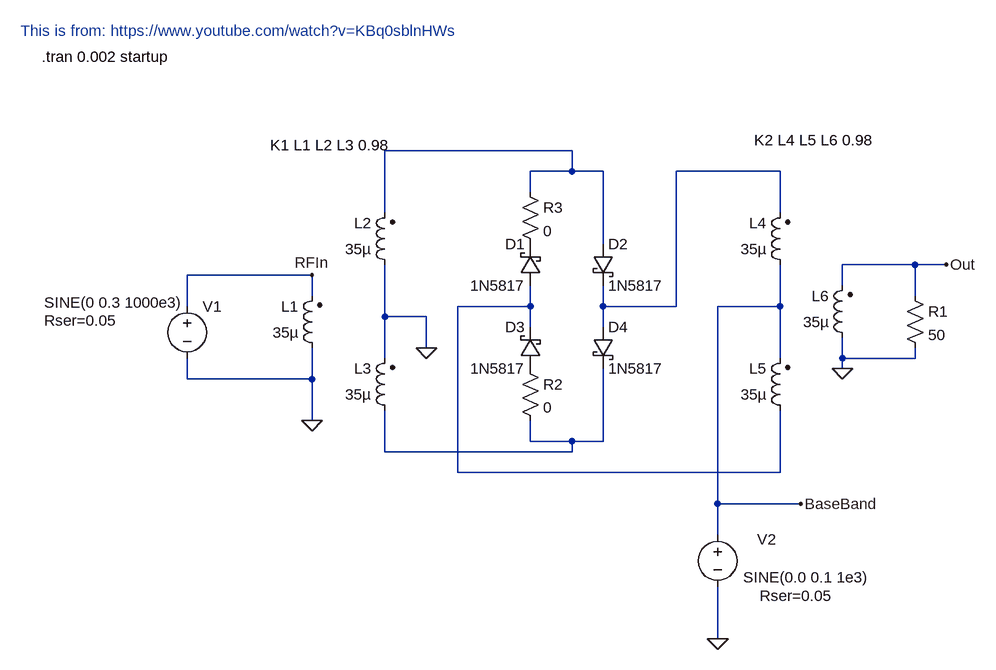
[diagram p0: schematic diode_ring_modulator_3.asc]
diode_ring_modulator_3.asc, the LTspice schematic file:
Version 4
SHEET 1 2596 716
WIRE 432 -112 144 -112
WIRE 432 -80 432 -112
WIRE 432 -80 368 -80
WIRE 480 -80 432 -80
WIRE 752 -80 592 -80
WIRE 368 -48 368 -80
WIRE 144 -16 144 -112
WIRE 752 -16 752 -80
WIRE 480 32 480 -80
WIRE 960 64 848 64
WIRE 1008 64 960 64
WIRE 32 80 -160 80
WIRE 848 96 848 64
WIRE 32 112 32 80
WIRE 960 112 960 64
WIRE -160 128 -160 80
WIRE 368 128 368 96
WIRE 368 128 256 128
WIRE 480 128 480 96
WIRE 592 128 592 -80
WIRE 592 128 480 128
WIRE 752 128 752 64
WIRE 752 128 656 128
WIRE 144 144 144 64
WIRE 208 144 144 144
WIRE 368 160 368 128
WIRE 480 160 480 128
WIRE 208 192 208 144
WIRE 144 208 144 144
WIRE 752 208 752 128
WIRE 848 208 848 176
WIRE 960 208 960 192
WIRE 960 208 848 208
WIRE 848 224 848 208
WIRE -160 240 -160 208
WIRE 32 240 32 192
WIRE 32 240 -160 240
WIRE 32 304 32 240
WIRE 368 336 368 304
WIRE 432 336 368 336
WIRE 480 336 480 224
WIRE 480 336 432 336
WIRE 144 352 144 288
WIRE 432 352 432 336
WIRE 432 352 144 352
WIRE 256 384 256 128
WIRE 752 384 752 288
WIRE 752 384 256 384
WIRE 656 432 656 128
WIRE 784 432 656 432
WIRE 656 480 656 432
WIRE 656 640 656 560
FLAG 32 304 0
FLAG 848 224 0
FLAG 1008 64 Out
FLAG 208 192 0
FLAG 656 640 0
FLAG 32 80 RFIn
FLAG 784 432 BaseBand
SYMBOL ind2 48 208 R180
WINDOW 0 36 80 Left 2
WINDOW 3 36 40 Left 2
SYMATTR InstName L1
SYMATTR Value 35µ
SYMATTR Type ind
SYMBOL ind2 160 80 R180
WINDOW 0 36 80 Left 2
WINDOW 3 36 40 Left 2
SYMATTR InstName L2
SYMATTR Value 35µ
SYMATTR Type ind
SYMBOL ind2 160 304 R180
WINDOW 0 36 80 Left 2
WINDOW 3 36 40 Left 2
SYMATTR InstName L3
SYMATTR Value 35µ
SYMATTR Type ind
SYMBOL schottky 384 96 R180
WINDOW 0 24 64 Left 2
WINDOW 3 24 0 Left 2
SYMATTR InstName D1
SYMATTR Value 1N5817
SYMATTR Description Diode
SYMATTR Type diode
SYMBOL schottky 384 224 R180
WINDOW 0 24 64 Left 2
WINDOW 3 24 0 Left 2
SYMATTR InstName D3
SYMATTR Value 1N5817
SYMATTR Description Diode
SYMATTR Type diode
SYMBOL schottky 464 160 R0
SYMATTR InstName D4
SYMATTR Value 1N5817
SYMATTR Description Diode
SYMATTR Type diode
SYMBOL ind2 768 80 R180
WINDOW 0 36 80 Left 2
WINDOW 3 36 40 Left 2
SYMATTR InstName L4
SYMATTR Value 35µ
SYMATTR Type ind
SYMBOL ind2 768 304 R180
WINDOW 0 36 80 Left 2
WINDOW 3 36 40 Left 2
SYMATTR InstName L5
SYMATTR Value 35µ
SYMATTR Type ind
SYMBOL ind2 864 192 R180
WINDOW 0 36 80 Left 2
WINDOW 3 36 40 Left 2
SYMATTR InstName L6
SYMATTR Value 35µ
SYMATTR Type ind
SYMBOL voltage -160 112 R0
WINDOW 3 -220 10 Left 2
WINDOW 123 0 0 Left 0
WINDOW 39 -220 38 Left 2
SYMATTR Value SINE(0 0.3 1000e3)
SYMATTR SpiceLine Rser=0.05
SYMATTR InstName V1
SYMBOL voltage 656 464 R0
WINDOW 0 76 38 Bottom 2
WINDOW 3 136 66 Top 2
WINDOW 123 0 0 Left 0
WINDOW 39 121 94 Top 2
SYMATTR InstName V2
SYMATTR Value SINE(0.0 0.1 1e3)
SYMATTR SpiceLine Rser=0.05
SYMBOL res 944 96 R0
SYMATTR InstName R1
SYMATTR Value 50
SYMBOL schottky 464 32 R0
SYMATTR InstName D2
SYMATTR Value 1N5817
SYMATTR Description Diode
SYMATTR Type diode
SYMBOL res 352 208 R0
SYMATTR InstName R2
SYMATTR Value 0
SYMBOL res 352 -64 R0
SYMATTR InstName R3
SYMATTR Value 0
TEXT 712 -128 Left 2 !K2 L4 L5 L6 0.98
TEXT -32 -120 Left 2 !K1 L1 L2 L3 0.98
TEXT -384 -256 Left 2 !.tran 0.002 startup
TEXT -416 -296 Left 2 ;This is from: https://www.youtube.com/watch?v=KBq0sblnHWs

The netlist it stands for:
* diode_ring_modulator_3.asc
L1 0 RFIn 35µ
L2 0 N001 35µ
L3 N004 0 35µ
D1 N003 P001 1N5817
D3 P002 N003 1N5817
D4 N002 N004 1N5817
L4 BaseBand N002 35µ
L5 N003 BaseBand 35µ
L6 0 Out 35µ
V1 RFIn 0 SINE(0 0.3 1000e3) Rser=0.05
V2 BaseBand 0 SINE(0.0 0.1 1e3) Rser=0.05
R1 Out 0 50
D2 N001 N002 1N5817
R2 P002 N004 0
R3 N001 P001 0
.model D D
.lib standard.dio
K2 L4 L5 L6 0.98
K1 L1 L2 L3 0.98
.tran 0.002 startup
* This is from: https://www.youtube.com/watch?v=KBq0sblnHWs
.backanno
.end